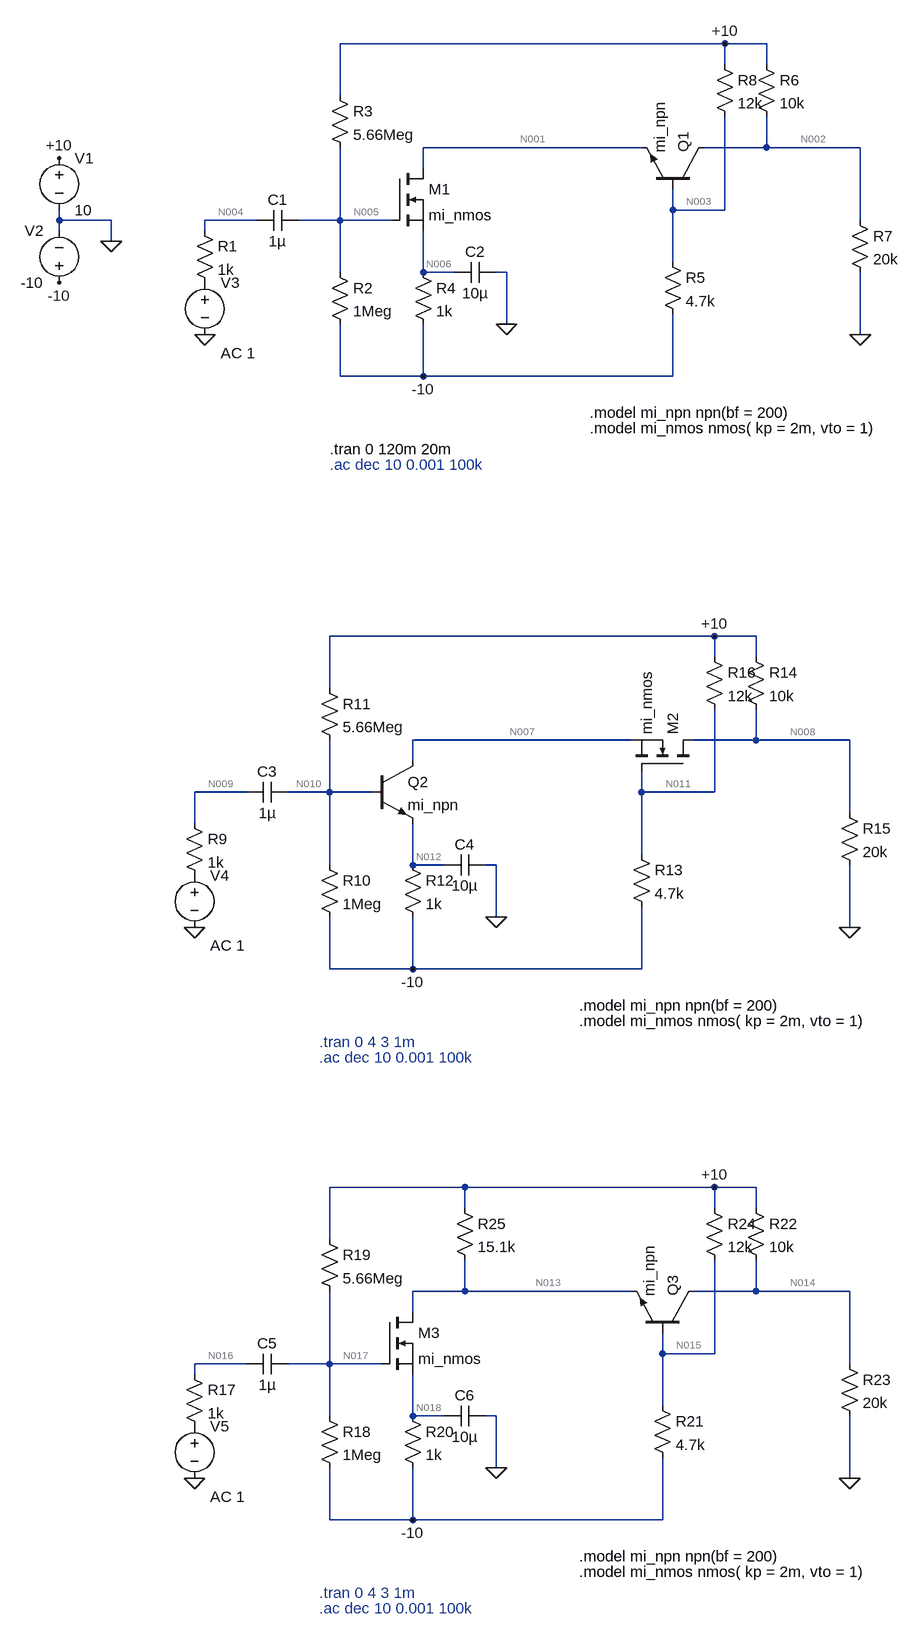
[diagram p0: schematic primer_recu.asc]
primer_recu.asc, the LTspice schematic file:
Version 4
SHEET 1 1184 2328
WIRE 672 -96 80 -96
WIRE 736 -96 672 -96
WIRE 672 -64 672 -96
WIRE 736 -64 736 -96
WIRE 80 -16 80 -96
WIRE 544 64 208 64
WIRE 736 64 736 16
WIRE 736 64 640 64
WIRE 880 64 736 64
WIRE 208 96 208 64
WIRE 592 160 592 128
WIRE 672 160 672 16
WIRE 672 160 592 160
WIRE -352 176 -352 160
WIRE -272 176 -352 176
WIRE -48 176 -128 176
WIRE 80 176 80 64
WIRE 80 176 16 176
WIRE 160 176 80 176
WIRE 880 176 880 64
WIRE -352 192 -352 176
WIRE -128 192 -128 176
WIRE -272 208 -272 176
WIRE 592 240 592 160
WIRE 80 256 80 176
WIRE 208 256 208 192
WIRE 256 256 208 256
WIRE 336 256 320 256
WIRE 336 336 336 256
WIRE 880 352 880 256
WIRE 80 416 80 336
WIRE 208 416 208 336
WIRE 208 416 80 416
WIRE 592 416 592 320
WIRE 592 416 208 416
WIRE 656 816 64 816
WIRE 720 816 656 816
WIRE 656 848 656 816
WIRE 720 848 720 816
WIRE 64 896 64 816
WIRE 528 976 192 976
WIRE 720 976 720 928
WIRE 720 976 624 976
WIRE 864 976 720 976
WIRE 192 1008 192 976
WIRE -64 1056 -144 1056
WIRE 64 1056 64 976
WIRE 64 1056 0 1056
WIRE 128 1056 64 1056
WIRE 544 1056 544 1024
WIRE 656 1056 656 928
WIRE 656 1056 544 1056
WIRE 864 1088 864 976
WIRE -144 1104 -144 1056
WIRE 544 1152 544 1056
WIRE 64 1168 64 1056
WIRE 192 1168 192 1104
WIRE 240 1168 192 1168
WIRE 320 1168 304 1168
WIRE 320 1248 320 1168
WIRE 864 1264 864 1168
WIRE 64 1328 64 1248
WIRE 192 1328 192 1248
WIRE 192 1328 64 1328
WIRE 544 1328 544 1232
WIRE 544 1328 192 1328
WIRE 272 1664 64 1664
WIRE 656 1664 272 1664
WIRE 720 1664 656 1664
WIRE 272 1696 272 1664
WIRE 656 1696 656 1664
WIRE 720 1696 720 1664
WIRE 64 1744 64 1664
WIRE 272 1824 272 1776
WIRE 272 1824 192 1824
WIRE 528 1824 272 1824
WIRE 720 1824 720 1776
WIRE 720 1824 624 1824
WIRE 864 1824 720 1824
WIRE 192 1856 192 1824
WIRE 576 1920 576 1888
WIRE 656 1920 656 1776
WIRE 656 1920 576 1920
WIRE -64 1936 -144 1936
WIRE 64 1936 64 1824
WIRE 64 1936 0 1936
WIRE 144 1936 64 1936
WIRE 864 1936 864 1824
WIRE -144 1952 -144 1936
WIRE 576 2000 576 1920
WIRE 64 2016 64 1936
WIRE 192 2016 192 1952
WIRE 240 2016 192 2016
WIRE 320 2016 304 2016
WIRE 320 2096 320 2016
WIRE 864 2112 864 2016
WIRE 64 2176 64 2096
WIRE 192 2176 192 2096
WIRE 192 2176 64 2176
WIRE 576 2176 576 2080
WIRE 576 2176 192 2176
FLAG -272 208 0
FLAG -128 352 0
FLAG 336 336 0
FLAG 880 352 0
FLAG 672 -96 +10
FLAG -352 80 +10
FLAG -352 272 -10
FLAG 208 416 -10
FLAG -144 1264 0
FLAG 320 1248 0
FLAG 864 1264 0
FLAG 656 816 +10
FLAG 192 1328 -10
FLAG -144 2112 0
FLAG 320 2096 0
FLAG 864 2112 0
FLAG 656 1664 +10
FLAG 192 2176 -10
SYMBOL voltage -352 64 R0
WINDOW 123 0 0 Left 0
WINDOW 39 0 0 Left 0
SYMATTR InstName V1
SYMATTR Value 10
SYMBOL voltage -352 288 R180
WINDOW 0 24 96 Left 2
WINDOW 3 24 16 Left 2
WINDOW 123 0 0 Left 0
WINDOW 39 0 0 Left 0
SYMATTR InstName V2
SYMATTR Value -10
SYMBOL voltage -128 256 R0
WINDOW 123 24 124 Left 2
WINDOW 39 0 0 Left 0
WINDOW 3 -194 162 Left 2
SYMATTR Value2 AC 1
SYMATTR InstName V3
SYMATTR Value ""
SYMBOL res -144 176 R0
SYMATTR InstName R1
SYMATTR Value 1k
SYMBOL cap 16 160 R90
WINDOW 0 0 32 VBottom 2
WINDOW 3 32 32 VTop 2
SYMATTR InstName C1
SYMATTR Value 1µ
SYMBOL res 64 240 R0
SYMATTR InstName R2
SYMATTR Value 1Meg
SYMBOL res 64 -32 R0
SYMATTR InstName R3
SYMATTR Value 5.66Meg
SYMBOL nmos 160 96 R0
SYMATTR InstName M1
SYMATTR Value mi_nmos
SYMBOL res 192 240 R0
SYMATTR InstName R4
SYMATTR Value 1k
SYMBOL cap 320 240 R90
WINDOW 0 0 32 VBottom 2
WINDOW 3 32 32 VTop 2
SYMATTR InstName C2
SYMATTR Value 10µ
SYMBOL npn 640 128 M270
SYMATTR InstName Q1
SYMATTR Value mi_npn
SYMBOL res 576 224 R0
SYMATTR InstName R5
SYMATTR Value 4.7k
SYMBOL res 720 -80 R0
SYMATTR InstName R6
SYMATTR Value 10k
SYMBOL res 864 160 R0
SYMATTR InstName R7
SYMATTR Value 20k
SYMBOL res 656 -80 R0
SYMATTR InstName R8
SYMATTR Value 12k
SYMBOL voltage -144 1168 R0
WINDOW 123 24 124 Left 2
WINDOW 39 0 0 Left 0
SYMATTR Value2 AC 1
SYMATTR InstName V4
SYMATTR Value ""
SYMBOL res -160 1088 R0
SYMATTR InstName R9
SYMATTR Value 1k
SYMBOL cap 0 1040 R90
WINDOW 0 0 32 VBottom 2
WINDOW 3 32 32 VTop 2
SYMATTR InstName C3
SYMATTR Value 1µ
SYMBOL res 48 1152 R0
SYMATTR InstName R10
SYMATTR Value 1Meg
SYMBOL res 48 880 R0
SYMATTR InstName R11
SYMATTR Value 5.66Meg
SYMBOL nmos 624 1024 M270
SYMATTR InstName M2
SYMATTR Value mi_nmos
SYMBOL res 176 1152 R0
SYMATTR InstName R12
SYMATTR Value 1k
SYMBOL cap 304 1152 R90
WINDOW 0 0 32 VBottom 2
WINDOW 3 32 32 VTop 2
SYMATTR InstName C4
SYMATTR Value 10µ
SYMBOL npn 128 1008 R0
SYMATTR InstName Q2
SYMATTR Value mi_npn
SYMBOL res 528 1136 R0
SYMATTR InstName R13
SYMATTR Value 4.7k
SYMBOL res 704 832 R0
SYMATTR InstName R14
SYMATTR Value 10k
SYMBOL res 848 1072 R0
SYMATTR InstName R15
SYMATTR Value 20k
SYMBOL res 640 832 R0
SYMATTR InstName R16
SYMATTR Value 12k
SYMBOL voltage -144 2016 R0
WINDOW 123 24 124 Left 2
WINDOW 39 0 0 Left 0
SYMATTR Value2 AC 1
SYMATTR InstName V5
SYMATTR Value ""
SYMBOL res -160 1936 R0
SYMATTR InstName R17
SYMATTR Value 1k
SYMBOL cap 0 1920 R90
WINDOW 0 0 32 VBottom 2
WINDOW 3 32 32 VTop 2
SYMATTR InstName C5
SYMATTR Value 1µ
SYMBOL res 48 2000 R0
SYMATTR InstName R18
SYMATTR Value 1Meg
SYMBOL res 48 1728 R0
SYMATTR InstName R19
SYMATTR Value 5.66Meg
SYMBOL nmos 144 1856 R0
SYMATTR InstName M3
SYMATTR Value mi_nmos
SYMBOL res 176 2000 R0
SYMATTR InstName R20
SYMATTR Value 1k
SYMBOL cap 304 2000 R90
WINDOW 0 0 32 VBottom 2
WINDOW 3 32 32 VTop 2
SYMATTR InstName C6
SYMATTR Value 10µ
SYMBOL npn 624 1888 M270
SYMATTR InstName Q3
SYMATTR Value mi_npn
SYMBOL res 560 1984 R0
SYMATTR InstName R21
SYMATTR Value 4.7k
SYMBOL res 704 1680 R0
SYMATTR InstName R22
SYMATTR Value 10k
SYMBOL res 848 1920 R0
SYMATTR InstName R23
SYMATTR Value 20k
SYMBOL res 640 1680 R0
SYMATTR InstName R24
SYMATTR Value 12k
SYMBOL res 256 1680 R0
SYMATTR InstName R25
SYMATTR Value 15.1k
TEXT 464 472 Left 2 !.model mi_npn npn(bf = 200)
TEXT 464 496 Left 2 !.model mi_nmos nmos( kp = 2m, vto = 1)
TEXT 64 528 Left 2 !.tran 0 120m 20m
TEXT 64 552 Left 2 ;.ac dec 10 0.001 100k
TEXT 448 1384 Left 2 !.model mi_npn npn(bf = 200)
TEXT 448 1408 Left 2 !.model mi_nmos nmos( kp = 2m, vto = 1)
TEXT 48 1440 Left 2 ;.tran 0 4 3 1m
TEXT 48 1464 Left 2 ;.ac dec 10 0.001 100k
TEXT 448 2232 Left 2 !.model mi_npn npn(bf = 200)
TEXT 448 2256 Left 2 !.model mi_nmos nmos( kp = 2m, vto = 1)
TEXT 48 2288 Left 2 ;.tran 0 4 3 1m
TEXT 48 2312 Left 2 ;.ac dec 10 0.001 100k

The netlist it stands for:
* primer_recu.asc
V1 +10 0 10
V2 -10 0 -10
V3 P001 0 AC 1
R1 N004 P001 1k
C1 N005 N004 1µ
R2 N005 -10 1Meg
R3 +10 N005 5.66Meg
M1 N001 N005 N006 N006 mi_nmos
R4 N006 -10 1k
C2 0 N006 10µ
Q1 N002 N003 N001 0 mi_npn
R5 N003 -10 4.7k
R6 +10 N002 10k
R7 N002 0 20k
R8 +10 N003 12k
V4 P002 0 AC 1
R9 N009 P002 1k
C3 N010 N009 1µ
R10 N010 -10 1Meg
R11 +10 N010 5.66Meg
M2 N008 N011 N007 N007 mi_nmos
R12 N012 -10 1k
C4 0 N012 10µ
Q2 N007 N010 N012 0 mi_npn
R13 N011 -10 4.7k
R14 +10 N008 10k
R15 N008 0 20k
R16 +10 N011 12k
V5 P003 0 AC 1
R17 N016 P003 1k
C5 N017 N016 1µ
R18 N017 -10 1Meg
R19 +10 N017 5.66Meg
M3 N013 N017 N018 N018 mi_nmos
R20 N018 -10 1k
C6 0 N018 10µ
Q3 N014 N015 N013 0 mi_npn
R21 N015 -10 4.7k
R22 +10 N014 10k
R23 N014 0 20k
R24 +10 N015 12k
R25 +10 N013 15.1k
.model NPN NPN
.model PNP PNP
.lib standard.bjt
.model NMOS NMOS
.model PMOS PMOS
.lib standard.mos
.model mi_npn npn(bf = 200)
.model mi_nmos nmos( kp = 2m, vto = 1)
.tran 0 120m 20m
* .ac dec 10 0.001 100k
.model mi_npn npn(bf = 200)
.model mi_nmos nmos( kp = 2m, vto = 1)
* .tran 0 4 3 1m
* .ac dec 10 0.001 100k
.model mi_npn npn(bf = 200)
.model mi_nmos nmos( kp = 2m, vto = 1)
* .tran 0 4 3 1m
* .ac dec 10 0.001 100k
.backanno
.end

* Results of the author's LTspice run, read from the files saved beside the schematic
* Operating Point, zero values left out:
*   V(+10) = 10 V
*   V(-10) = -10 V
*   V(n005) = -6.997 V
*   V(n001) = -5.162 V
*   V(n006) = -8.998 V
*   V(n002) = 19.88 mV
*   V(n003) = -4.388 V
*   V(n010) = -8.817 V
*   V(n008) = 3.811 V
*   V(n011) = -4.371 V
*   V(n007) = -6.026 V
*   V(n012) = -9.569 V
*   V(n017) = -6.997 V
*   V(n013) = -5.019 V
*   V(n018) = -8.998 V
*   V(n014) = 6.618 V
*   V(n015) = -4.371 V
*   Ic(Q1) = 997 µA
*   Ib(Q1) = 4.985 µA
*   Ie(Q1) = -1.002 mA
*   Ic(Q2) = 428.4 µA
*   Ib(Q2) = 2.142 µA
*   Ie(Q2) = -430.5 µA
*   Ic(Q3) = 7.358 µA
*   Ib(Q3) = 36.78 nA
*   Ie(Q3) = -7.395 µA
*   Id(M1) = 1.002 mA
*   Ib(M1) = -3.846 pA
*   Is(M1) = -1.002 mA
*   Id(M2) = 428.4 µA
*   Ib(M2) = -9.847 pA
*   Is(M2) = -428.4 µA
*   Id(M3) = 1.002 mA
*   Ib(M3) = -3.989 pA
*   Is(M3) = -1.002 mA
*   I(R2) = 3.003 µA
*   I(R3) = 3.003 µA
*   I(R4) = 1.002 mA
*   I(R5) = 1.194 mA
*   I(R6) = 998 µA
*   I(R7) = 994.2 nA
*   I(R8) = 1.199 mA
*   I(R10) = 1.183 µA
*   I(R11) = 3.325 µA
*   I(R12) = 430.5 µA
*   I(R13) = 1.198 mA
*   I(R14) = 618.9 µA
*   I(R15) = 190.5 µA
*   I(R16) = 1.198 mA
*   I(R18) = 3.003 µA
*   I(R19) = 3.003 µA
*   I(R20) = 1.002 mA
*   I(R21) = 1.198 mA
*   I(R22) = 338.2 µA
*   I(R23) = 330.9 µA
*   I(R24) = 1.198 mA
*   I(R25) = 994.6 µA
*   I(V1) = -6.553 mA
*   I(V2) = 6.031 mA
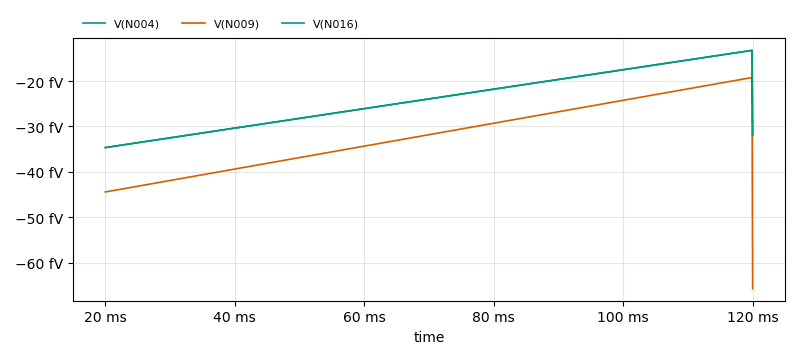
[diagram p1: Transient Analysis of primer_recu.asc, plotted from the saved traces]
* Transient Analysis, 1 run:
*   V(N004): min -34.64 fV, max -13.24 fV, average -23.94 fV, rms 26.22 fV, last -31.97 fV
*   V(N009): min -65.73 fV, max -19.22 fV, average -31.82 fV, rms 34.23 fV, last -65.73 fV
*   V(N016): min -34.64 fV, max -13.24 fV, average -23.94 fV, rms 26.22 fV, last -31.97 fV